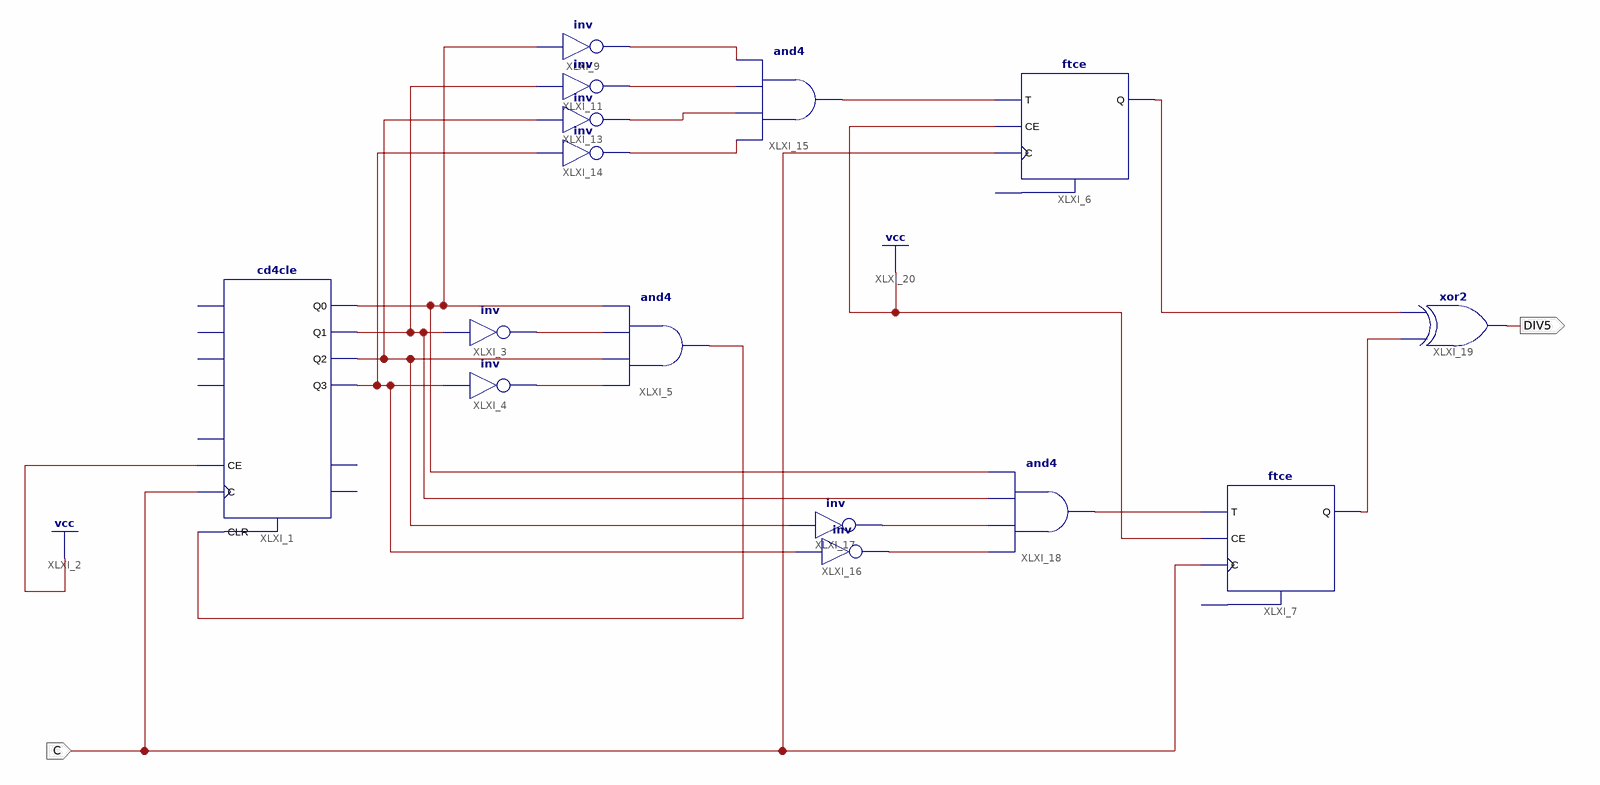
[diagram p0: schematic sheet 1]
// Xilinx ISE schematic Counter5.sch (spartan6) as structural Verilog: 15 symbols, 2 ports
module Counter5 (
  input  C,
  output DIV5
);

  wire XLXN_4, XLXN_5, XLXN_6, XLXN_7, XLXN_8, XLXN_11, XLXN_12, XLXN_13, XLXN_14, XLXN_15, XLXN_19, XLXN_20,
       XLXN_29, XLXN_30, XLXN_43, XLXN_56, XLXN_57;

  cd4cle XLXI_1 (
    .C(C), .CE(1'b1), .CLR(XLXN_8), .Q0(XLXN_19), .Q1(XLXN_4), .Q2(XLXN_11), .Q3(XLXN_5));  // open: D0, D1, D2, D3, L, CEO, TC
  not XLXI_3 (XLXN_6, XLXN_4);
  not XLXI_4 (XLXN_7, XLXN_5);
  and XLXI_5 (XLXN_8, XLXN_7, XLXN_11, XLXN_6, XLXN_19);
  ftce XLXI_7 (.C(C), .CE(1'b1), .T(XLXN_57), .Q(XLXN_30));  // open: CLR
  not XLXI_9 (XLXN_12, XLXN_19);
  not XLXI_11 (XLXN_13, XLXN_4);
  not XLXI_13 (XLXN_14, XLXN_11);
  not XLXI_14 (XLXN_15, XLXN_5);
  and XLXI_15 (XLXN_56, XLXN_15, XLXN_14, XLXN_13, XLXN_12);
  ftce XLXI_6 (.C(C), .CE(1'b1), .T(XLXN_56), .Q(XLXN_29));  // open: CLR
  not XLXI_16 (XLXN_43, XLXN_5);
  not XLXI_17 (XLXN_20, XLXN_11);
  and XLXI_18 (XLXN_57, XLXN_43, XLXN_20, XLXN_4, XLXN_19);
  xor XLXI_19 (DIV5, XLXN_30, XLXN_29);
endmodule
